# EAGLE schematic 491 Circuit Schematic (EAGLE 9.5.0)
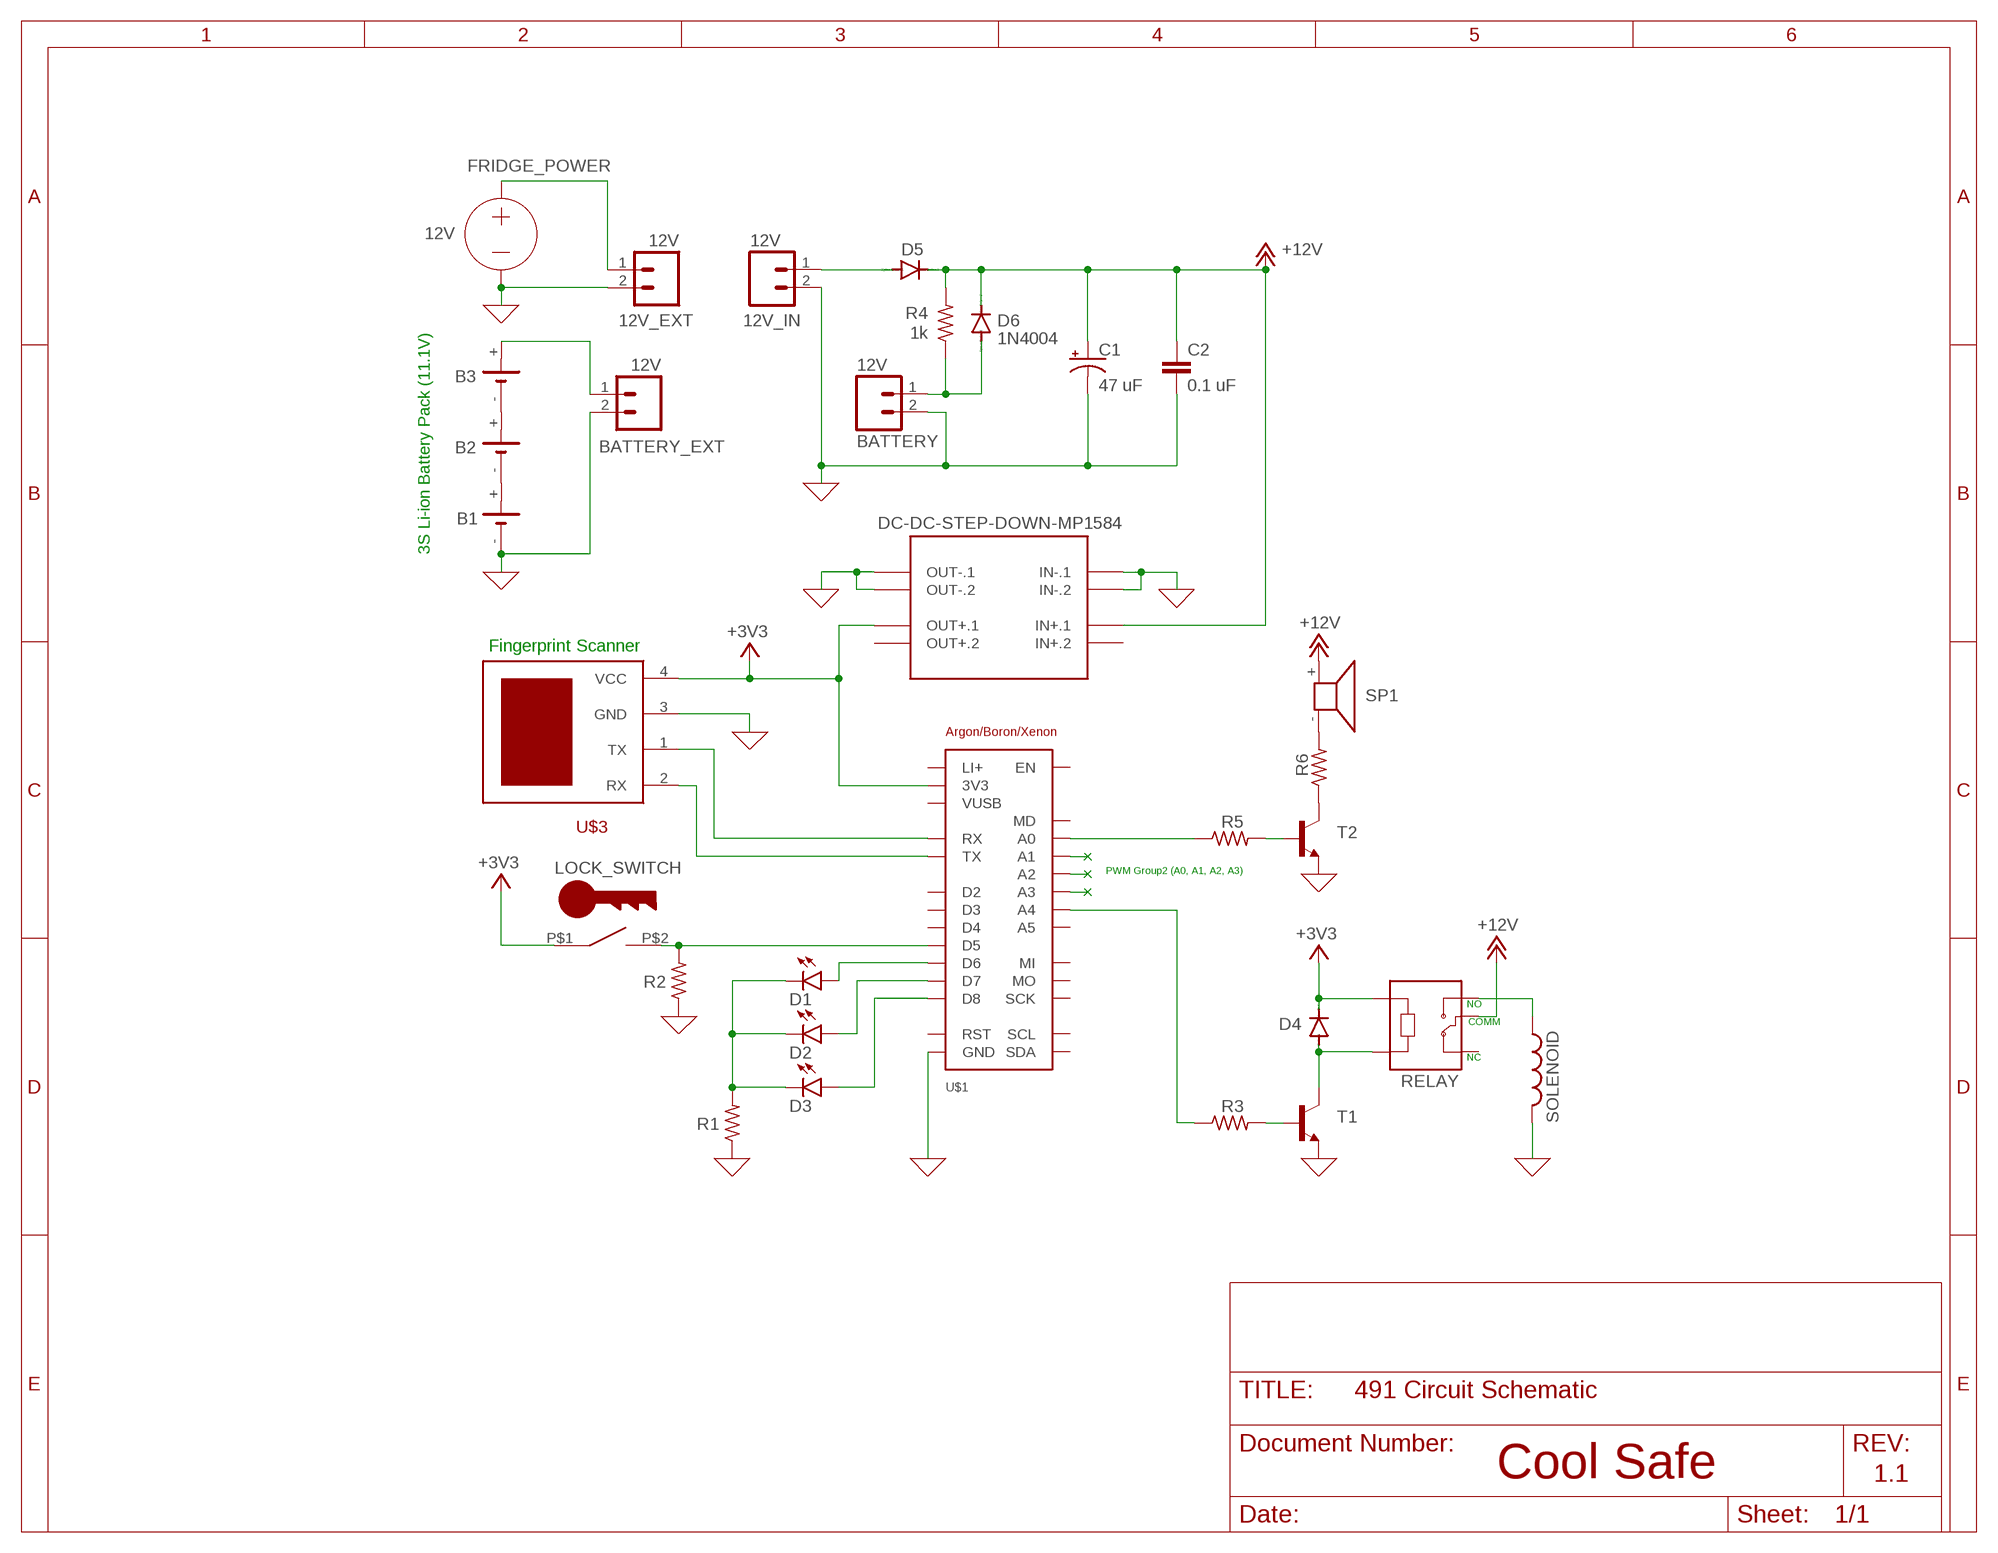
[diagram p0: schematic, sheet 1]

## Parts
12V_EXT  12V  M02  [02P]
12V_IN  12V  M02  [02P]
B1  SL-340/P3.6V  [SL-340/P3.6V]
B2  SL-340/P3.6V  [SL-340/P3.6V]
B3  SL-340/P3.6V  [SL-340/P3.6V]
BATTERY  12V  M02  [02P]
BATTERY_EXT  12V  M02  [02P]
C1  47 uF  CPOL-USE2.5-6  [E2,5-6]
C2  0.1 uF  C2.5/5  [C2.5-5]
D1  U57X32  [U57X32]
D2  U57X32  [U57X32]
D3  U57X32  [U57X32]
D4  1N4004  [DO41-10]
D5  1N4004  [DO41-10]
D6  1N4004  [DO41-10]
FRIDGE_POWER  12V  VOLTAGE  (no package)
L2  SOLENOID  L-US0207/5V  [0207/5V]
LOCK_SWITCH  LOCK_SWITCH  [SWITCH_TERMINAL]
R1  R-US_0204/7  [0204/7]
R2  R-US_0204/7  [0204/7]
R3  R-US_0204/7  [0204/7]
R4  1k  R-US_0207/10  [0207/10]
R5  R-US_0204/7  [0204/7]
R6  R-US_0204/7  [0204/7]
RELAY  SRD-05VDC-SL-C  [RELAY_SRD-05VDC-SL-C]
SP1  KSS1201  [KSS1201]
T1  -NPN-TO92  [TO92]
T2  -NPN-TO92  [TO92]
U$1  TEMPLATE_ARGON/BORON/XENONFEATHER_ONLY  [FEATHER_ONLY]
U$2  DC-DC-STEP-DOWN-MP1584  [DC-DC-STEP-DOWN-MP1584]
U$3  FPS  [JST]

## Nets
0: 12V_EXT.2 12V_IN.2 B1.- BATTERY.2 BATTERY_EXT.2 C1.- C2.2 FRIDGE_POWER.- L2.2 R1.1 R2.1 T1.1(E) T2.1(E) U$1.16B(GND) U$1.16T(GND) U$2.IN-.1 U$2.IN-.2 U$2.OUT-.1 U$2.OUT-.2 U$3.3(GND) ; supply symbol labelled GND
+3V3: D4.C LOCK_SWITCH.P$1 RELAY.A1 U$1.14B(3V3) U$1.14T(3V3) U$2.OUT+.1 U$3.4(VCC)
+12V: C1.+ C2.1 D5.C D6.C R4.2 RELAY.COM SP1.+ U$2.IN+.1
N$1: 12V_EXT.1 FRIDGE_POWER.+
N$2: R5.2 T2.2(B)
N$3: B2.+ B3.-
N$4: R5.1 U$1.17B(A0) U$1.17T(A0)
N$5: B1.+ B2.-
N$6: D1.A U$1.06B(D6) U$1.06T(D6)
N$7: D2.A U$1.05B(D7) U$1.05T(D7)
N$8: D3.A U$1.04B(D8) U$1.04T(D8)
N$9: LOCK_SWITCH.P$2 R2.2 U$1.07B(D5) U$1.07T(D5)
N$10: D1.K(C) D2.K(C) D3.K(C) R1.2
N$11: D4.A RELAY.A2 T1.3(C)
N$13: L2.1 RELAY.NO
N$14: BATTERY.1 D6.A R4.1
N$15: R6.1 T2.3(C)
N$16: U$1.26B(RX) U$1.26T(RX) U$3.1(TX)
N$17: R3.2 T1.2(B)
N$18: R3.1 U$1.21B(A4) U$1.21T(A4)
N$19: U$1.18B(A1) U$1.18T(A1)
N$22: U$1.19B(A2) U$1.19T(A2)
N$25: U$1.20B(A3) U$1.20T(A3)
N$28: U$1.27B(TX) U$1.27T(TX) U$3.2(RX)
N$29: 12V_IN.1 D5.A
N$30: B3.+ BATTERY_EXT.1
N$31: R6.2 SP1.-
Unconnected: RELAY.NC U$1.01B(LI+) U$1.01T(LI+) U$1.02B(EN) U$1.02T(EN) U$1.03B(VUSB) U$1.03T(VUSB) U$1.08B(D4) U$1.08T(D4) U$1.09B(D3) U$1.09T(D3) U$1.10B(D2) U$1.10T(D2) U$1.11B(SCL) U$1.11T(SCL) U$1.12B(SDA) U$1.12T(SDA) U$1.13B(RST) U$1.13T(RST) U$1.15B(MD) U$1.15T(MD) U$1.22B(A5) U$1.22T(A5) U$1.23B(SCK) U$1.23T(SCK) U$1.24B(MO) U$1.24T(MO) U$1.25B(MI) U$1.25T(MI) U$2.IN+.2 U$2.OUT+.2

## Notes on the sheet
- 3S Li-ion Battery Pack (11.1V)
- Fingerprint Scanner
- PWM Group2 (A0, A1, A2, A3)
- NO
- COMM
- NC
- Cool Safe | 1.1

## Library data of the parts
12V_EXT 12V_IN BATTERY BATTERY_EXT = con-amp-quick:M02: AMP QUICK CONNECTOR; OC_FARNELL: unknown; OC_NEWARK: unknown
B1-B3 = battery:SL-340/P3.6V: LI BATTERY Sonnenschein
C1 = rcl:CPOL-US: POLARIZED CAPACITOR, American symbol; SPICEPREFIX: C
C2 = capacitor-wima:C: CAPACITOR naming: grid - package width
D1-D3 = led:U57X32: LED rectangle, 5.7 x 3.2 mm
D4-D6 = diode:1N4004: DIODE general purpose rectifier, 1 A
FRIDGE_POWER = ngspice-simulation:VOLTAGE: Independent Voltage Source, either DC, AC, PULSE, SINE, PWL, EXP, or SFFM; VALUE: 0V
L2 = rcl:L-US: INDUCTOR, American symbol; SPICEPREFIX: L
LOCK_SWITCH = cool_safe_lib:LOCK_SWITCH
R1-R6 = rcl:R-US_: RESISTOR, American symbol; SPICEPREFIX: R
RELAY = SRD-05VDC-SL-C:SRD-05VDC-SL-C: 5V Trigger Relay Module For Arduino And Raspberry Pi 5V Trigger Relay Module For Arduino And Raspberry Pi; AVAILABILITY: Unavailable; DESCRIPTION: 5V Trigger Relay Module For Arduino And Raspberry Pi 5V Trigger Relay Module For Arduino And Raspberry Pi; MF: Songle Relay; MP: SRD-05VDC-SL-C; PACKAGE: None; PRICE: None
SP1 = buzzer:KSS1201: SPEAKER Source: Schukat; OC_FARNELL: unknown; OC_NEWARK: unknown
T1 T2 = transistor:*-NPN-: NPN Transistror BF959 corrected 2008.03.06
U$1 = cool_safe_lib:TEMPLATE_ARGON/BORON/XENON
U$2 = cool_safe_lib:DC-DC-STEP-DOWN-MP1584: DC/DC Step-Down Regulator based on MP1584 chip MP1584 datasheet available here: http://www.haoyuelectronics.com/Attachment/MP1584/MP1584.pdf Click here to find device on ebay.com <http://www.ebay.com/sch/mp1584+module>
U$3 = cool_safe_lib:FPS

## Module SWITCHINGMODULE
Ports: 

### Library data of the parts